# Altium schematic sheet 11. USB.SchDoc
size A3
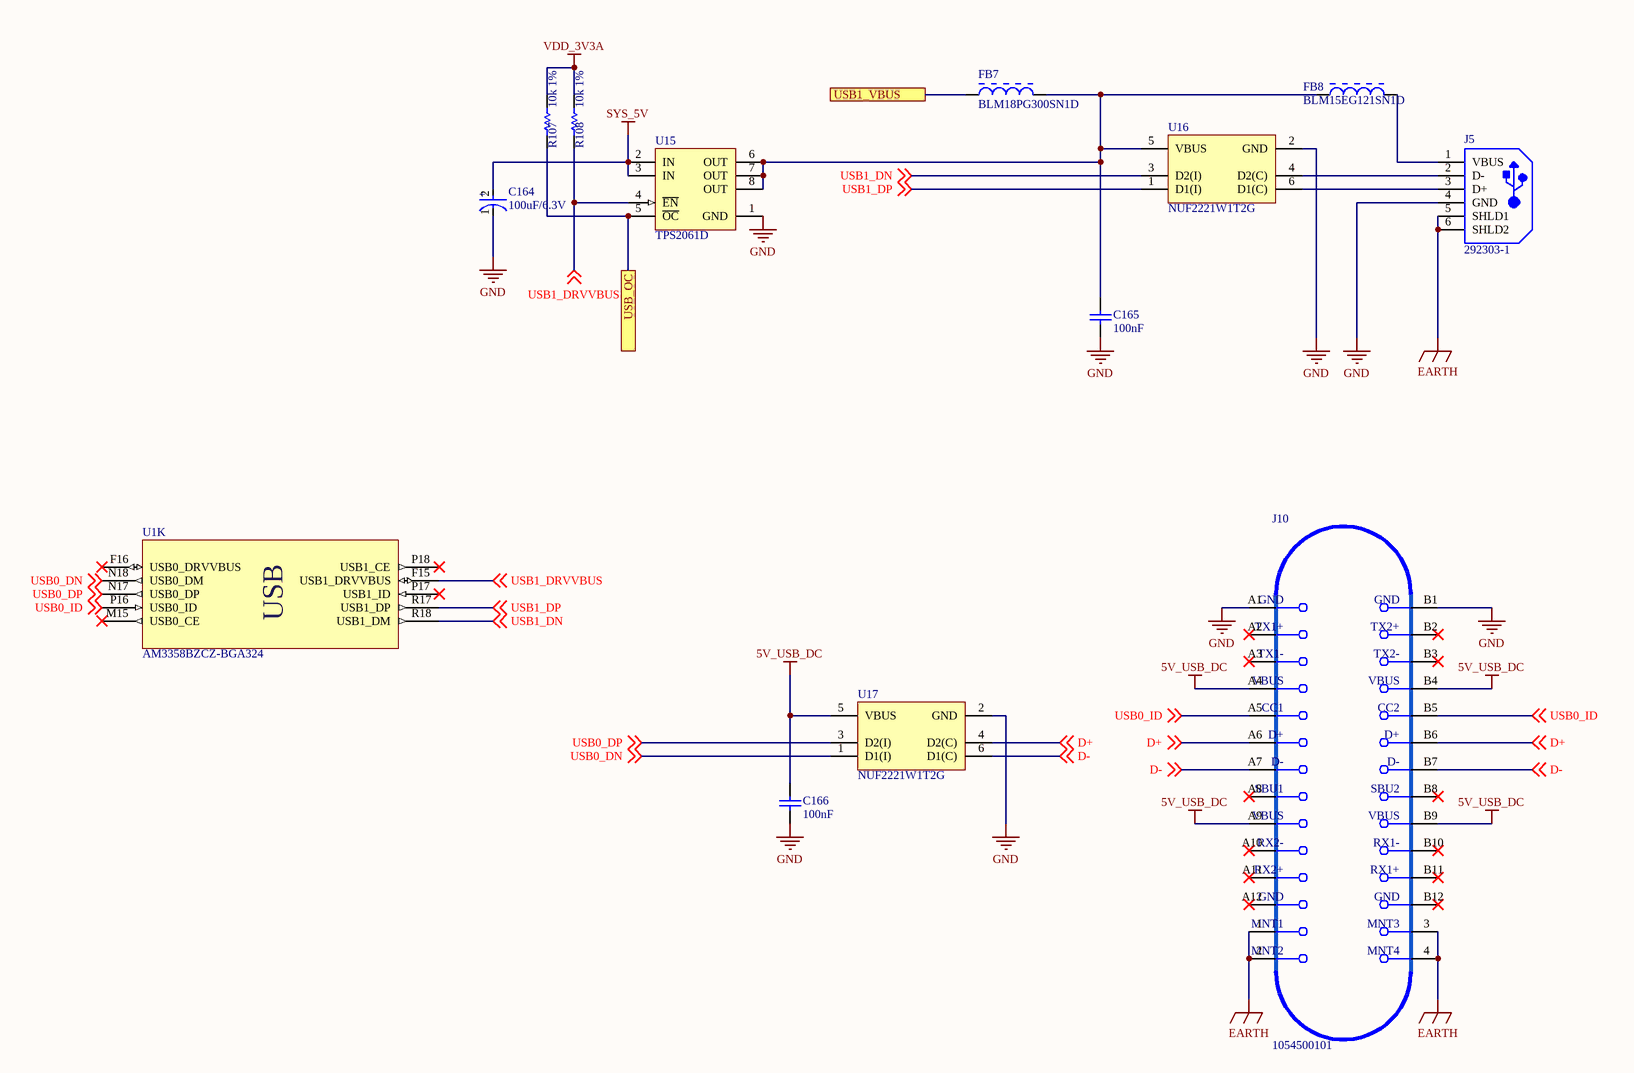
[diagram p0: 11. USB.SchDoc]

## Parts
C164  100uF/6.3V  [FP-NLJB-MFG]
C165  100nF  [CAPC1005X55X25LL05T10]
C166  100nF  [CAPC1005X55X25LL05T10]
FB7  BLM18PG300SN1D  [MURA-BLM18PG_KG-CHIP-2_V1]
FB8  BLM15EG121SN1D  [MURA-BLM15-CHIP-2_V]
J5  292303-1  [TE-292303-1_V]
J10  1054500101  [FP-1054500101-MFG]
R107  10k 1%  [RESC1005X40X25LL05T05]
R108  10k 1%  [RESC1005X40X25LL05T05]
U1  AM3358BZCZ-BGA324  [TI-ZCZ324]  (part K of 11)
U15  TPS2061D  [D0008A_N]
U16  NUF2221W1T2G  [ONSC-SC70-6-419B-02_W_V]
U17  NUF2221W1T2G  [ONSC-SC70-6-419B-02_W_V]

## Ports
USB1_VBUS, USB_OC

## Nets
5V_USB_DC: C166.2 J10.A4(VBUS) J10.A9(VBUS) J10.B4(VBUS) J10.B9(VBUS) U17.5(VBUS)
EARTH: J5.5(SHLD1) J5.6(SHLD2) J10.1(MNT_1) J10.2(MNT_2) J10.3(MNT_3) J10.4(MNT_4)
GND: C164.1(C) C165.1 C166.1 J5.4(GND) J10.A1(GND) J10.B1(GND) U15.1(GND) U16.2(GND) U17.2(GND)
SYS_5V: C164.2(A) U15.2(IN) U15.3(IN)
VDD_3V3A: R107.2 R108.2
D+: J10.A6(D+) J10.B6(D+) U17.4(D2(C)) ; off-sheet D+
D-: J10.A7(D-) J10.B7(D-) U17.6(D1(C)) ; off-sheet D-
USB0_DN: U1.N18(USB0_DM) U17.1(D1(I)) ; off-sheet USB0_DN
USB0_DP: U1.N17(USB0_DP) U17.3(D2(I)) ; off-sheet USB0_DP
USB0_ID: J10.A5(CC1) J10.B5(CC2) U1.P16(USB0_ID) ; off-sheet USB0_ID
USB1_DN: U1.R18(USB1_DM) U16.3(D2(I)) ; off-sheet USB1_DN
USB1_DP: U1.R17(USB1_DP) U16.1(D1(I)) ; off-sheet USB1_DP
USB1_DRVVBUS: R108.1 U1.F15(USB1_DRVVBUS) U15.4(~{EN}) ; off-sheet USB1_DRVVBUS
USB1_VBUS: FB7.1 ; port USB1_VBUS
USB_OC: R107.1 U15.5(~{OC}) ; port USB_OC
NetC165_2: C165.2 FB7.2 FB8.1 U15.6(OUT) U15.7(OUT) U15.8(OUT) U16.5(VBUS)
NetFB8_2: FB8.2 J5.1(VBUS)
NetJ5_2: J5.2(D-) U16.4(D2(C))
NetJ5_3: J5.3(D+) U16.6(D1(C))

Not connected (* = marked no-connect by the designer): J10 A2(TX1+)* A3(TX1-)* A8(SBU1)* A10(RX2-)* A11(RX2+)* A12(GND)* B2(TX2+)* B3(TX2-)* B8(SBU2)* B10(RX1-)* B11(RX1+)* B12(GND)*; U1 F16(USB0_DRVVBUS)* M15(USB0_CE)* P17(USB1_ID)* P18(USB1_CE)*

## Notes on the sheet
- Title
- Size:
- Date:
- A4
- Number:
- Time:
- Revision:
- Sheet
- of
- N.S.T
- Design by:
- Check by:
- https://github.com/tung080827
- (in symbol AM3358BZCZ100, part K) USB
- (in symbol CMP-04425-000004-1) +
- (in symbol USB-C) MNT1; MNT3; MNT2; MNT4

## Library data of the parts
C164 = CMP-04425-000004-1: CAP NIOB OXI 100UF 20% 6.3V 1210; Manufacturer: AVX Corporation; Manufacturer Part Number: NLJB107M006R1700; Leakage Current: 60uA; Life: 1000Hours; Ripple Current: 245mA; Material: Niobium Oxide; Esr: 1700mΩ; Temperature Coefficient: +25/-20%; Height: 2.1mm; Voltage Rating: 6.3V; Package: NLJB; Digikey Description: CAP NIOB OXI 100UF 20% 6.3V 1210; ComponentLink2Description: Datasheet; RoHS: TRUE; Mouser Description: Niobium Oxide Capacitors 6.3volts 100uF 20% ESR=1700mOhms; Footprint Url: https://www.avx.com/download/software/literature/AVX-Footprint-Library.pdf; Capacitance: 100uF; Temperature Range High: +105°C; Temperature: -55°C to +105°C; Temperature Range Low: -55°C; Device Class L3: Niobium Oxide; ComponentLink2URL: http://datasheets.avx.com/NLJ.pdf; Device Class L1: Passive Components; Automotive: No; Value: 100uF; Tolerance: 20%; Lead Free: Yes; Category: Cap; Device Class L2: Capacitors; Octopart: https://octopart.com/nljb107m006r1700-avx-10566967
C165 C166 = CMP-2100-03641-1: Chip Capacitor, 0.1 uF, +/- 10%, 16 V, -55 to 125 degC, 0402 (1005 Metric), RoHS, Tape and Reel; Manufacturer: Murata; Material: Ceramic; Insulation Resistance: 10GR; Voltage: 16V; Dielectric: X7R; REACH SVHC: NoSVHC; Depth: 0.5mm; Case/Package: 0402; Datasheet URL: http://psearch.en.murata.com/capacitor/product/GRM155R71C104KA88%23.pdf; Lead Free: LeadFree; Dielectric Material: Ceramic; Manufacturer URL: http://www.murata.com/; Min Operating Temperature: -55degC; Length: 1mm; Case Code (Metric): 1005; Radiation Hardening: No; Package Reference: 0402; RoHSCompliant: true; Datasheet Version: 42675.0; Thickness: 0.022inch; Packaging: TapeandReel; Voltage Rating (DC): 16V; Tolerance: 10%; Max Operating Temperature: 125degC; Package Description: 2-Pin Surface Mount Device, Body 1 x 0.5 mm; Mount: SurfaceMount; Height: 0.5mm; Width: 0.5mm; Number of Pins: 2; Voltage Rating: 16V; Case Code (Imperial): 0402; Termination: SMD/SMT; Capacitance: 100nF; Package Quantity: 1
FB7 = CMP-0686-00572-2: Chip Ferrite Bead for Power Lines, 30 Ohm, 1000 mA, -55 to 125 degC, 1.6 x 0.8 x 0.95 mm SMD, Tape and Reel; Manufacturer: Murata; DC Resistance: 0.05 Ohm Max.; Impedance (at 100 MHz): 30 Ohm Typ.; Rated Current: 1000 mA; ComponentLink1Description: Manufacturer URL; Packing: Tape and Reel; ComponentLink2URL: http://www.murata.com/products/catalog/pdf/c31e.pdf; DatasheetVersion: 08/2013; PartNumber: BLM18PG300SN1D; Mounting Technology: Surface Mount; ComponentLink2Description: Datasheet; PackageReference: BLM18_H950-2; Operating Temperature Range: -55 to 125 degC; ComponentLink3Description: Package Specification; PackageDescription: 2-Pin Chip, Body 1.6 x 0.8 mm; ComponentLink1URL: http://www.murata.com/; ComponentLink3URL: http://www.murata.com/products/catalog/pdf/c31e.pdf
FB8 = CMP-0686-00148-3: Chip Ferrite Bead for GHz Band General Use (Low DC Resistance Type), 120 Ohm, 1500 mA, -55 to 125 degC, 1 x 0.5 x 0.55 mm SMD, Tape and Reel; Manufacturer: Murata; Rated Current: 1500 mA; Impedance (at 100 MHz): 120 Ohm +/- 25%; DC Resistance: 0.095 Ohm Max.; ComponentLink3URL: http://www.murata.com/products/catalog/pdf/c31e.pdf; ComponentLink1URL: http://www.murata.com/; Packing: Tape and Reel; Operating Temperature Range: -55 to 125 degC; PackageReference: BLM15-2; ComponentLink2Description: Datasheet; PackageDescription: 2-Pin Chip, Body 1 x 0.5 mm; ComponentLink2URL: http://www.murata.com/products/catalog/pdf/c31e.pdf; Mounting Technology: Surface Mount; ComponentLink3Description: Package Specification; ComponentLink1Description: Manufacturer URL; PartNumber: BLM15EG121SN1D; DatasheetVersion: 08/2013
J5 = CMP-2000-05404-1: 1 Port Right Angle Through Hole Mount Female Type A USB Connector, 4 Position, -55 to 85 degC, RoHS, Tube; Manufacturer: TE Connectivity; Contact Termination Type: Solder; No. of Contacts: 4; Connector Mounting: PCB; SVHC: NoSVHC(16-Jun-2014); Gender: Receptacle; Connector Type: USBA; Package Description: 4-Pin Through Hole Device, Body 14 x 13.13 mm, Pitch 2.5 mm; Contact Plating: Gold; Package Reference: 292303-1; Contact Material: Copper; Datasheet URL: http://www.farnell.com/cad/1653030.pdf; Datasheet Version: Feb-12; Manufacturer URL: http://www.te.com/
J10 = USB-C: CONN RCP USB3.1 TYPEC 24P SMD RA; Manufacturer: Molex; Number Of Contacts: 24; Voltage Rating: 30V; Shielding: true; Is Female: yes; Current Rating: 0.25/1.25/5A; Pitch: 0.5mm; Conn Orientation: Right Angle; Package: 0; Height: 3.44mm; Footprint Url: https://www.molex.com/pdm_docs/sd/1054500101_sd.pdf; Device Class L1: Connectors; Category: Conn; Device Class L2: USB Connectors; Digikey Description: CONN RCP USB3.1 TYPEC 24P SMD RA; Contact Material: Gold,Nickel; Mouser Description: USB Shielded I/O Receptacle; Type C; Right Angle; Surface Mount; Gold over Nickel; ComponentLink2Description: Datasheet; Lead Free: Yes; Automotive: No; Temperature Range High: +85°C; RoHS: TRUE; Octopart: https://octopart.com/105450-0101-molex-68082325; ComponentLink2URL: https://www.molex.com/webdocs/datasheets/pdf/en-us/1054500101_IO_CONNECTORS.pdf; Temperature: -30°C to +85°C; Usb Standard: USB 3.1; Temperature Range Low: -30°C; Device Class L3: unset; Manufacturer Part Number: 1054500101
R107 R108 = CMP-2002-08135-1: 10k 0.063W 1% 0402 (1005 Metric)  SMD; Manufacturer: Vishay Dale; Part Number: CRCW040210K0FKED
U1 = AM3358BZCZ100: Sitara ARM Cortex-A8 32-Bit RISC Microprocessor, 1 GHz, SGX530 3D Graphics Engine, Programmable Real-Time Unit and Industrial Communication Subsystem (PRU-ICSS), 0 to 90 degC, 324-pin NFBGA (ZCZ), Green (RoHS & no Sb/Br); Supplier 1: Digi-Key
U15 = CMP-0337-00164-2: Single 1 A Current-Limited, Power-Distribution Switch, 1.5 A Current Limit, -40 to 85 degC, 8-pin SOIC (D), Green (RoHS & no Sb/Br); Manufacturer: Texas Instruments; NEMKO: TRUE; Continuous Current(Max)(A): 1; rDS(on) per FET(Typ)(mOhms): 70; Current Limit(A): 1.5; Enable: Active Low; Vin(Min)(V): 2.7; Vin(Max)(V): 5.5; Rating: Catalog; UL Listed: TRUE; PackageReference: D0008A; Code_JEDEC: MS-012AA; Eco-Plan: Green (RoHS & no Sb/Br); PackageDescription: 8-Pin Plastic Small Outline Integrated Circuit, 4.9 x 3.9 mm, Pitch 1.27 mm Pitch; PartNumber: TPS2061D; ComponentLink1Description: Datasheet; Mounting Technology: Surface Mount; ComponentLink1URL: http://www.ti.com/general/docs/lit/getliterature.tsp?genericPartNumber=TPS2061&fileType=pdf; DatasheetVersion: SLVS490I; Number of Switches: 1; PackageVersion: revM, Jun-2011
U16 U17 = CMP-1066-00023-1: USB Upstream Terminator with ESD Protection, -55 to 125 degC, 6-Pin SC70, Pb-Free, Tape and Reel; Manufacturer: On Semiconductor; C Typ (pF): 42; Number of Lines: 3; V(BR) Typ (V): 6.8; VRWM Max (V): 5.25; RoHS: Pb-Free; ComponentLink1Description: Manufacturer URL; ComponentLink3Description: Package Specification; ComponentLink2URL: http://www.onsemi.cn/pub_link/Collateral/NUF2221W1T2-D.PDF; PackageDescription: 6-Pin Small Outline Transistor, Body 2 x 1.25 mm, Pitch 0.65 mm; DatasheetVersion: Rev. 0; PartNumber: NUF2221W1T2G; ComponentLink2Description: Datasheet; PackageVersion: Rev. W; Mounting Technology: Surface Mount; ComponentLink1URL: http://www.onsemi.com/; Packing: Tape and Reel; PackageReference: SC70-6-419B-02_W; ComponentLink3URL: http://www.onsemi.com/pub_link/Collateral/SMF05C-D.PDF